# Altium schematic sheet CON_PCI_Express_X16_164PIN.SchDoc: PCI Express x16 164Pin
size A4
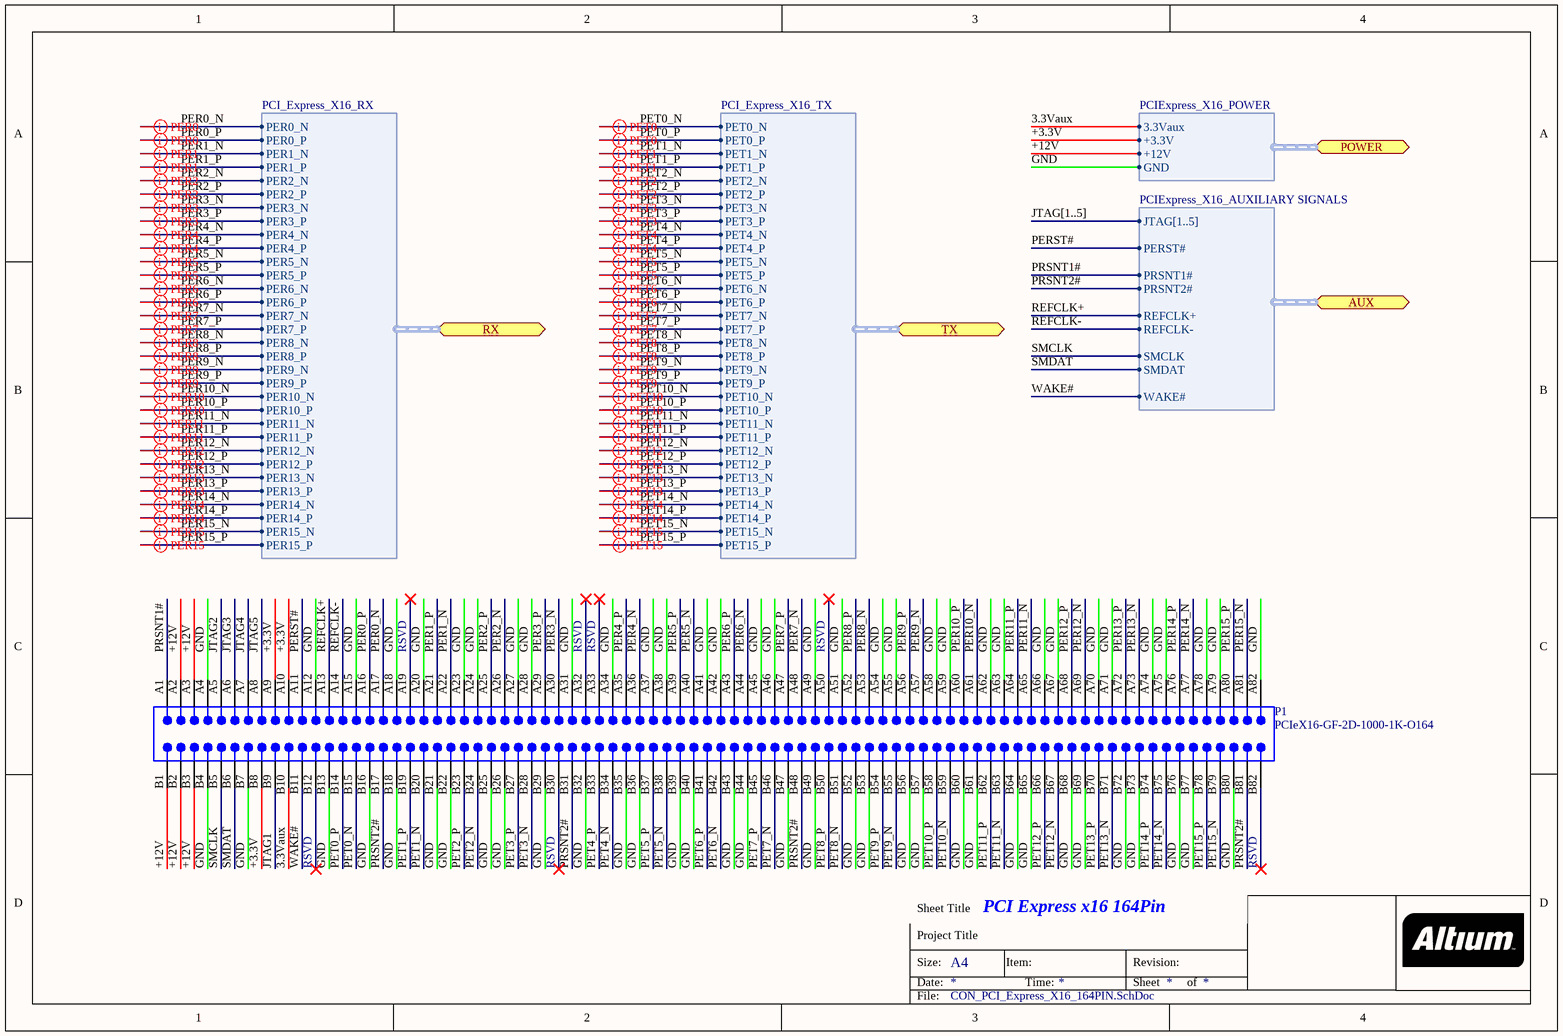
[diagram p0: CON_PCI_Express_X16_164PIN.SchDoc]

## Parts
P1  PCIeX16-GF-2D-1000-1K-O164  [PCIeX16-GF-2D-1000-1K-O164]  (no BOM)

## Ports
AUX (harness PCIExpress_X16_AUXILIARY SIGNALS), POWER (harness PCIExpress_X16_POWER), RX (harness PCI_Express_X16_RX), TX (harness PCI_Express_X16_TX)

## Harnesses
PCI_Express_X16_RX: PER0_N, PER0_P, PER1_N, PER1_P, PER2_N, PER2_P, PER3_N, PER3_P, PER4_N, PER4_P, PER5_N, PER5_P, PER6_N, PER6_P, PER7_N, PER7_P, PER8_N, PER8_P, PER9_N, PER9_P, PER10_N, PER10_P, PER11_N, PER11_P, PER12_N, PER12_P, PER13_N, PER13_P, PER14_N, PER14_P, PER15_N, PER15_P
PCI_Express_X16_TX: PET0_N, PET0_P, PET1_N, PET1_P, PET2_N, PET2_P, PET3_N, PET3_P, PET4_N, PET4_P, PET5_N, PET5_P, PET6_N, PET6_P, PET7_N, PET7_P, PET8_N, PET8_P, PET9_N, PET9_P, PET10_N, PET10_P, PET11_N, PET11_P, PET12_N, PET12_P, PET13_N, PET13_P, PET14_N, PET14_P, PET15_N, PET15_P
PCIExpress_X16_POWER: +3.3V, +12V, GND, 3.3Vaux
PCIExpress_X16_AUXILIARY SIGNALS: JTAG[1..5], PERST#, PRSNT1#, PRSNT2#, REFCLK+, REFCLK-, SMCLK, SMDAT, WAKE#

## Nets
3.3Vaux: P1.B10 ; port POWER.3.3Vaux
+3.3V: P1.A9 P1.A10 P1.B8 ; port POWER.+3.3V
+12V: P1.A2 P1.A3 P1.B1 P1.B2 P1.B3 ; port POWER.+12V
GND: P1.A4 P1.A12 P1.A15 P1.A18 P1.A20 P1.A23 P1.A24 P1.A27 P1.A28 P1.A31 P1.A34 P1.A37 P1.A38 P1.A41 P1.A42 P1.A45 P1.A46 P1.A49 P1.A51 P1.A54 P1.A55 P1.A58 P1.A59 P1.A62 P1.A63 P1.A66 P1.A67 P1.A70 P1.A71 P1.A74 P1.A75 P1.A78 P1.A79 P1.A82 P1.B4 P1.B7 P1.B13 P1.B16 P1.B18 P1.B21 P1.B22 P1.B25 P1.B26 P1.B29 P1.B32 P1.B35 P1.B36 P1.B39 P1.B40 P1.B43 P1.B44 P1.B47 P1.B49 P1.B52 P1.B53 P1.B56 P1.B57 P1.B60 P1.B61 P1.B64 P1.B65 P1.B68 P1.B69 P1.B72 P1.B73 P1.B76 P1.B77 P1.B80 ; port POWER.GND
JTAG1: P1.B9
JTAG2: P1.A5
JTAG3: P1.A6
JTAG4: P1.A7
JTAG5: P1.A8
PER0_N: P1.A17 ; port RX.PER0_N
PER0_P: P1.A16 ; port RX.PER0_P
PER1_N: P1.A22 ; port RX.PER1_N
PER1_P: P1.A21 ; port RX.PER1_P
PER2_N: P1.A26 ; port RX.PER2_N
PER2_P: P1.A25 ; port RX.PER2_P
PER3_N: P1.A30 ; port RX.PER3_N
PER3_P: P1.A29 ; port RX.PER3_P
PER4_N: P1.A36 ; port RX.PER4_N
PER4_P: P1.A35 ; port RX.PER4_P
PER5_N: P1.A40 ; port RX.PER5_N
PER5_P: P1.A39 ; port RX.PER5_P
PER6_N: P1.A44 ; port RX.PER6_N
PER6_P: P1.A43 ; port RX.PER6_P
PER7_N: P1.A48 ; port RX.PER7_N
PER7_P: P1.A47 ; port RX.PER7_P
PER8_N: P1.A53 ; port RX.PER8_N
PER8_P: P1.A52 ; port RX.PER8_P
PER9_N: P1.A57 ; port RX.PER9_N
PER9_P: P1.A56 ; port RX.PER9_P
PER10_N: P1.A61 ; port RX.PER10_N
PER10_P: P1.A60 ; port RX.PER10_P
PER11_N: P1.A65 ; port RX.PER11_N
PER11_P: P1.A64 ; port RX.PER11_P
PER12_N: P1.A69 ; port RX.PER12_N
PER12_P: P1.A68 ; port RX.PER12_P
PER13_N: P1.A73 ; port RX.PER13_N
PER13_P: P1.A72 ; port RX.PER13_P
PER14_N: P1.A77 ; port RX.PER14_N
PER14_P: P1.A76 ; port RX.PER14_P
PER15_N: P1.A81 ; port RX.PER15_N
PER15_P: P1.A80 ; port RX.PER15_P
PERST#: P1.A11 ; port AUX.PERST#
PET0_N: P1.B15 ; port TX.PET0_N
PET0_P: P1.B14 ; port TX.PET0_P
PET1_N: P1.B20 ; port TX.PET1_N
PET1_P: P1.B19 ; port TX.PET1_P
PET2_N: P1.B24 ; port TX.PET2_N
PET2_P: P1.B23 ; port TX.PET2_P
PET3_N: P1.B28 ; port TX.PET3_N
PET3_P: P1.B27 ; port TX.PET3_P
PET4_N: P1.B34 ; port TX.PET4_N
PET4_P: P1.B33 ; port TX.PET4_P
PET5_N: P1.B38 ; port TX.PET5_N
PET5_P: P1.B37 ; port TX.PET5_P
PET6_N: P1.B42 ; port TX.PET6_N
PET6_P: P1.B41 ; port TX.PET6_P
PET7_N: P1.B46 ; port TX.PET7_N
PET7_P: P1.B45 ; port TX.PET7_P
PET8_N: P1.B51 ; port TX.PET8_N
PET8_P: P1.B50 ; port TX.PET8_P
PET9_N: P1.B55 ; port TX.PET9_N
PET9_P: P1.B54 ; port TX.PET9_P
PET10_N: P1.B59 ; port TX.PET10_N
PET10_P: P1.B58 ; port TX.PET10_P
PET11_N: P1.B63 ; port TX.PET11_N
PET11_P: P1.B62 ; port TX.PET11_P
PET12_N: P1.B67 ; port TX.PET12_N
PET12_P: P1.B66 ; port TX.PET12_P
PET13_N: P1.B71 ; port TX.PET13_N
PET13_P: P1.B70 ; port TX.PET13_P
PET14_N: P1.B75 ; port TX.PET14_N
PET14_P: P1.B74 ; port TX.PET14_P
PET15_N: P1.B79 ; port TX.PET15_N
PET15_P: P1.B78 ; port TX.PET15_P
PRSNT1#: P1.A1 ; port AUX.PRSNT1#
PRSNT2#: P1.B17 P1.B31 P1.B48 P1.B81 ; port AUX.PRSNT2#
REFCLK+: P1.A13 ; port AUX.REFCLK+
REFCLK-: P1.A14 ; port AUX.REFCLK-
SMCLK: P1.B5 ; port AUX.SMCLK
SMDAT: P1.B6 ; port AUX.SMDAT
WAKE#: P1.B11 ; port AUX.WAKE#

Not connected (* = marked no-connect by the designer): P1 A19* A32* A33* A50* B12* B30* B82*

## Buses and harness runs
bus JTAG[1..5]

## Layout directives
differential pair: PER0_N, PER0_P, PER1_N, PER1_P, PER2_N, PER2_P, PER3_N, PER3_P, PER4_N, PER4_P, PER5_N, PER5_P, PER6_N, PER6_P, PER7_N, PER7_P, PER8_N, PER8_P, PER9_N, PER9_P, PER10_N, PER10_P, PER11_N, PER11_P, PER12_N, PER12_P, PER13_N, PER13_P, PER14_N, PER14_P, PER15_N, PER15_P, PET0_N, PET0_P, PET1_N, PET1_P, PET2_N, PET2_P, PET3_N, PET3_P, PET4_N, PET4_P, PET5_N, PET5_P, PET6_N, PET6_P, PET7_N, PET7_P, PET8_N, PET8_P, PET9_N, PET9_P, PET10_N, PET10_P, PET11_N, PET11_P, PET12_N, PET12_P, PET13_N, PET13_P, PET14_N, PET14_P, PET15_N, PET15_P

## Notes on the sheet
- RSVD
- Sheet Title
- Project Title
- Size:
- Date:
- A4
- Item:
- Time:
- Revision:
- Sheet
- of
- File:

## Library data of the parts
P1 = CMP-0001-00033-2: Golden finger, PCIeX16, Dual, Opposite, Pitch 1mm, 164-Position; Mating Connector: Molex-87715-9305; Package Reference: PCIeX16-GF-2D-1000-1K-O164; Publisher: Altium; Datasheet Version: rev2.0, Apr-2007; ClassName: Edge Connector